# Altium schematic sheet Sheet7.SchDoc
size B; SheetNumber: 4; SheetTotal: 7
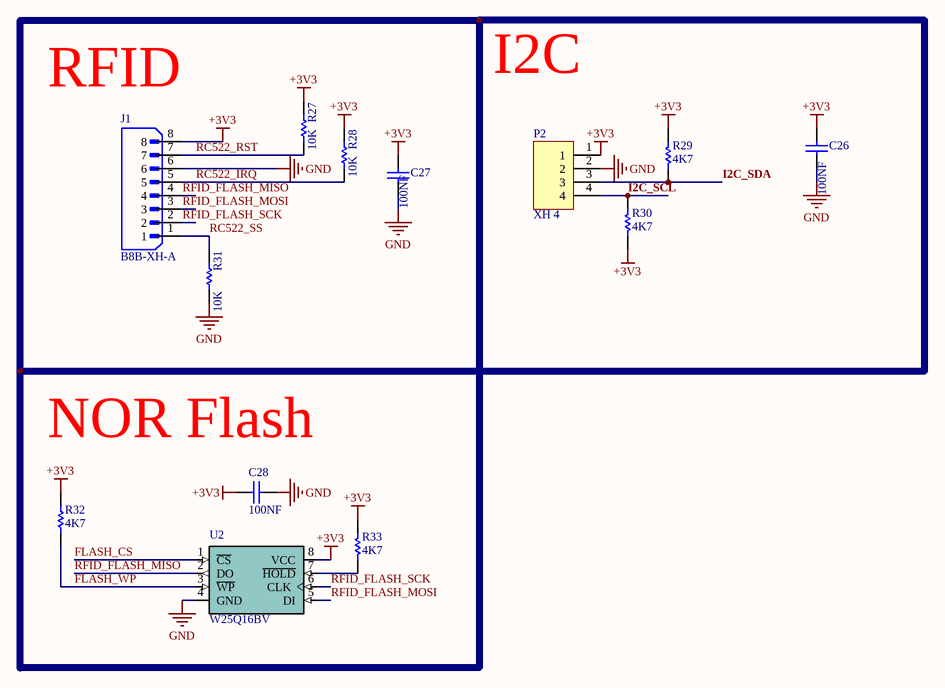
[diagram p0: Sheet7.SchDoc]

## Parts
C26  100NF  [CAP0603]
C27  100NF  [CAP0603]
C28  100NF  [CAP0603]
J1  B8B-XH-A  [JST_B8B-XH-A]
P2  XH 4  [XH 4 PIN]
R27  10K  [R0603]
R28  10K  [R0603]
R29  4K7  [R0603]
R30  4K7  [R0603]
R31  10K  [R0603]
R32  4K7  [R0603]
R33  4K7  [R0603]
U2  W25Q16BV  [SO08]

## Nets
+3V3: C26.2 C27.2 C28.2 J1.8 P2.1 R27.2 R28.2 R29.1 R30.2 R32.1 R33.1 U2.8(VCC)
GND: C26.1 C27.1 C28.1 J1.6 P2.2 R31.1 U2.4(GND)
FLASH_CS: U2.1(~{CS})
FLASH_WP: R32.2 U2.3(~{WP})
I2C_SCL: P2.4 R30.1
I2C_SDA: P2.3 R29.2
RC522_IRQ: J1.5 R28.1
RC522_RST: J1.7 R27.1
RC522_SS: J1.1 R31.2
RFID_FLASH_MISO: J1.4 U2.2(DO)
RFID_FLASH_MOSI: J1.3 U2.5(DI)
RFID_FLASH_SCK: J1.2 U2.6(CLK)
NetR33_2: R33.2 U2.7(~{HOLD})

## Notes on the sheet
- I2C
- (near J1) RFID
- NOR Flash

## Library data of the parts
C26-C28 = CAP SMD PACKAGE: TOTAL CAPACITOR SMD PACK; Designer: Abbas Basereh; Desc.: CAP SMD TOTAL PACKAGES; Data: 2017-3-10; VALUE: 100nF
J1 = B8B-XH-A: Connector Header Through Hole 8 position 0.098 (2.50mm); MF: JST; SnapEDA_Link: https://www.snapeda.com/parts/B8B-XH-A/JST/view-part/?ref=snap; Package: None; Value: *; MP: B8B-XH-A; Check_prices: https://www.snapeda.com/parts/B8B-XH-A/JST/view-part/?ref=eda
P2 = Conector XH 4 Pin: ComponentLink1Description: Tarahiboard; ComponentLink1URL: https://www.tarahiboard.com/product/library-pack; DatasheetVersion: 2022
R27 R28 R31 = Resistor SMD 0603: Value: 1K; DatasheetVersion: 2021; ComponentLink1Description: Website Smart World; ComponentLink1URL: https://www.smartw.ir/; ComponentLink2Description: Telegram; ComponentLink2URL: https://t.me/altium_smartw; ComponentLink3Description: Instagram; ComponentLink3URL: https://Instagram.com/smartgw.ir
R29 R30 R32 R33 = Resistor SMD 0603: DatasheetVersion: 2021; ComponentLink1Description: Website Smart World; ComponentLink1URL: https://www.smartw.ir/; ComponentLink2Description: Telegram; ComponentLink2URL: https://t.me/altium_smartw; ComponentLink3Description: Instagram; ComponentLink3URL: https://Instagram.com/smartgw.ir
U2 = W25Q16BV: Flash, pin, soic, flash, Memory, Semiconductors and Actives, serial, ic; ComponentLink1Description: Website Smart World; ComponentLink1URL: https://www.smartw.ir/; ComponentLink2Description: Telegram; ComponentLink2URL: https://t.me/altium_smartw; ComponentLink3Description: Instagram; ComponentLink3URL: https://Instagram.com/smartgw.ir; DatasheetVersion: 2021